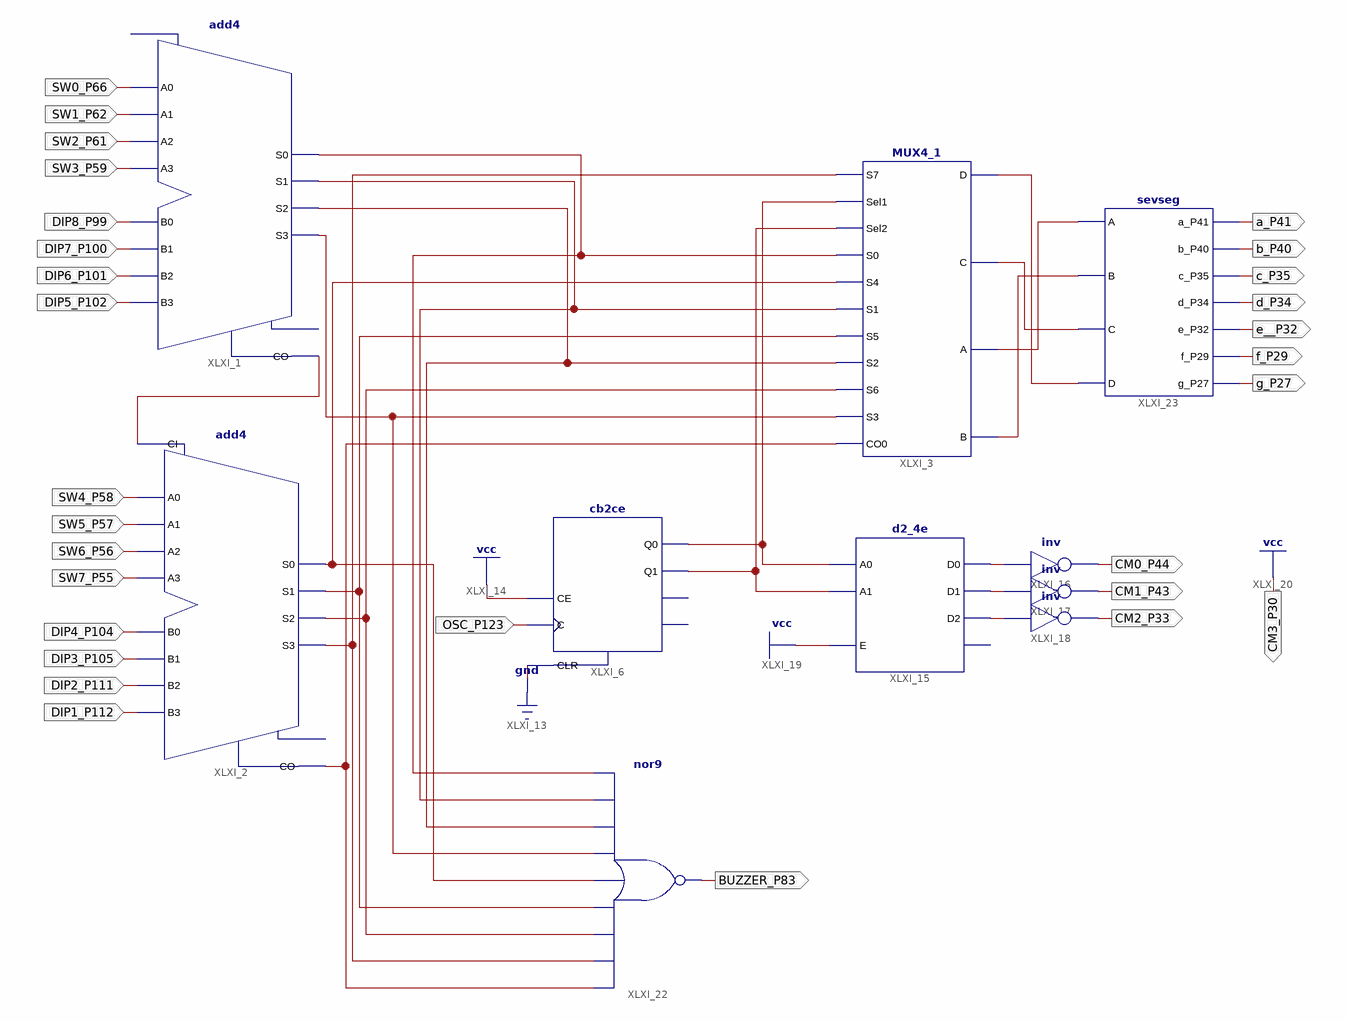
[diagram p0: schematic sheet 1]
// Xilinx ISE schematic lab8Adder.sch (spartan6) as structural Verilog: 10 symbols, 29 ports
module lab8Adder (
  input  DIP1_P112,
  input  DIP2_P111,
  input  DIP3_P105,
  input  DIP4_P104,
  input  SW7_P55,
  input  SW6_P56,
  input  SW5_P57,
  input  SW4_P58,
  input  DIP5_P102,
  input  DIP6_P101,
  input  DIP7_P100,
  input  DIP8_P99,
  input  SW3_P59,
  input  SW2_P61,
  input  SW1_P62,
  input  SW0_P66,
  input  OSC_P123,
  output a_P41,
  output b_P40,
  output c_P35,
  output d_P34,
  output e__P32,
  output f_P29,
  output g_P27,
  output CM0_P44,
  output CM1_P43,
  output CM2_P33,
  output CM3_P30,
  output BUZZER_P83
);

  wire XLXN_1, XLXN_18, XLXN_19, XLXN_20, XLXN_21, XLXN_22, XLXN_23, XLXN_24, XLXN_25, XLXN_26, XLXN_27,
       XLXN_28, XLXN_29, XLXN_30, XLXN_89, XLXN_90, XLXN_100, XLXN_101, XLXN_102;

  cb2ce XLXI_6 (.C(OSC_P123), .CE(1'b1), .CLR(1'b0), .Q0(XLXN_89), .Q1(XLXN_90));  // open: CEO, TC
  MUX4_1 XLXI_3 (
    .S7(XLXN_25), .Sel1(XLXN_89), .Sel2(XLXN_90), .S0(XLXN_18), .S4(XLXN_22), .S1(XLXN_19), .S5(XLXN_23),
    .S2(XLXN_20), .S6(XLXN_24), .S3(XLXN_21), .CO0(XLXN_26), .D(XLXN_28), .C(XLXN_29), .A(XLXN_27),
    .B(XLXN_30));
  add4 XLXI_2 (
    .A0(SW4_P58), .A1(SW5_P57), .A2(SW6_P56), .A3(SW7_P55), .B0(DIP4_P104), .B1(DIP3_P105), .B2(DIP2_P111),
    .B3(DIP1_P112), .CI(XLXN_1), .CO(XLXN_26), .S0(XLXN_22), .S1(XLXN_23), .S2(XLXN_24), .S3(XLXN_25));  // open: OFL
  add4 XLXI_1 (
    .A0(SW0_P66), .A1(SW1_P62), .A2(SW2_P61), .A3(SW3_P59), .B0(DIP8_P99), .B1(DIP7_P100), .B2(DIP6_P101),
    .B3(DIP5_P102), .CO(XLXN_1), .S0(XLXN_18), .S1(XLXN_19), .S2(XLXN_20), .S3(XLXN_21));  // open: CI, OFL
  d2_4e XLXI_15 (.A0(XLXN_89), .A1(XLXN_90), .E(1'b1), .D0(XLXN_100), .D1(XLXN_101), .D2(XLXN_102));  // open: D3
  not XLXI_16 (CM0_P44, XLXN_100);
  not XLXI_17 (CM1_P43, XLXN_101);
  not XLXI_18 (CM2_P33, XLXN_102);
  nor XLXI_22 (BUZZER_P83, XLXN_26, XLXN_25, XLXN_24, XLXN_23, XLXN_22, XLXN_21, XLXN_20, XLXN_19, XLXN_18);
  sevseg XLXI_23 (
    .A(XLXN_27), .B(XLXN_30), .C(XLXN_29), .D(XLXN_28), .a_P41(a_P41), .b_P40(b_P40), .c_P35(c_P35),
    .d_P34(d_P34), .e_P32(e__P32), .f_P29(f_P29), .g_P27(g_P27));

  assign CM3_P30 = 1'b1;
endmodule
